# EAGLE design silverduino (EAGLE 8.1.0)
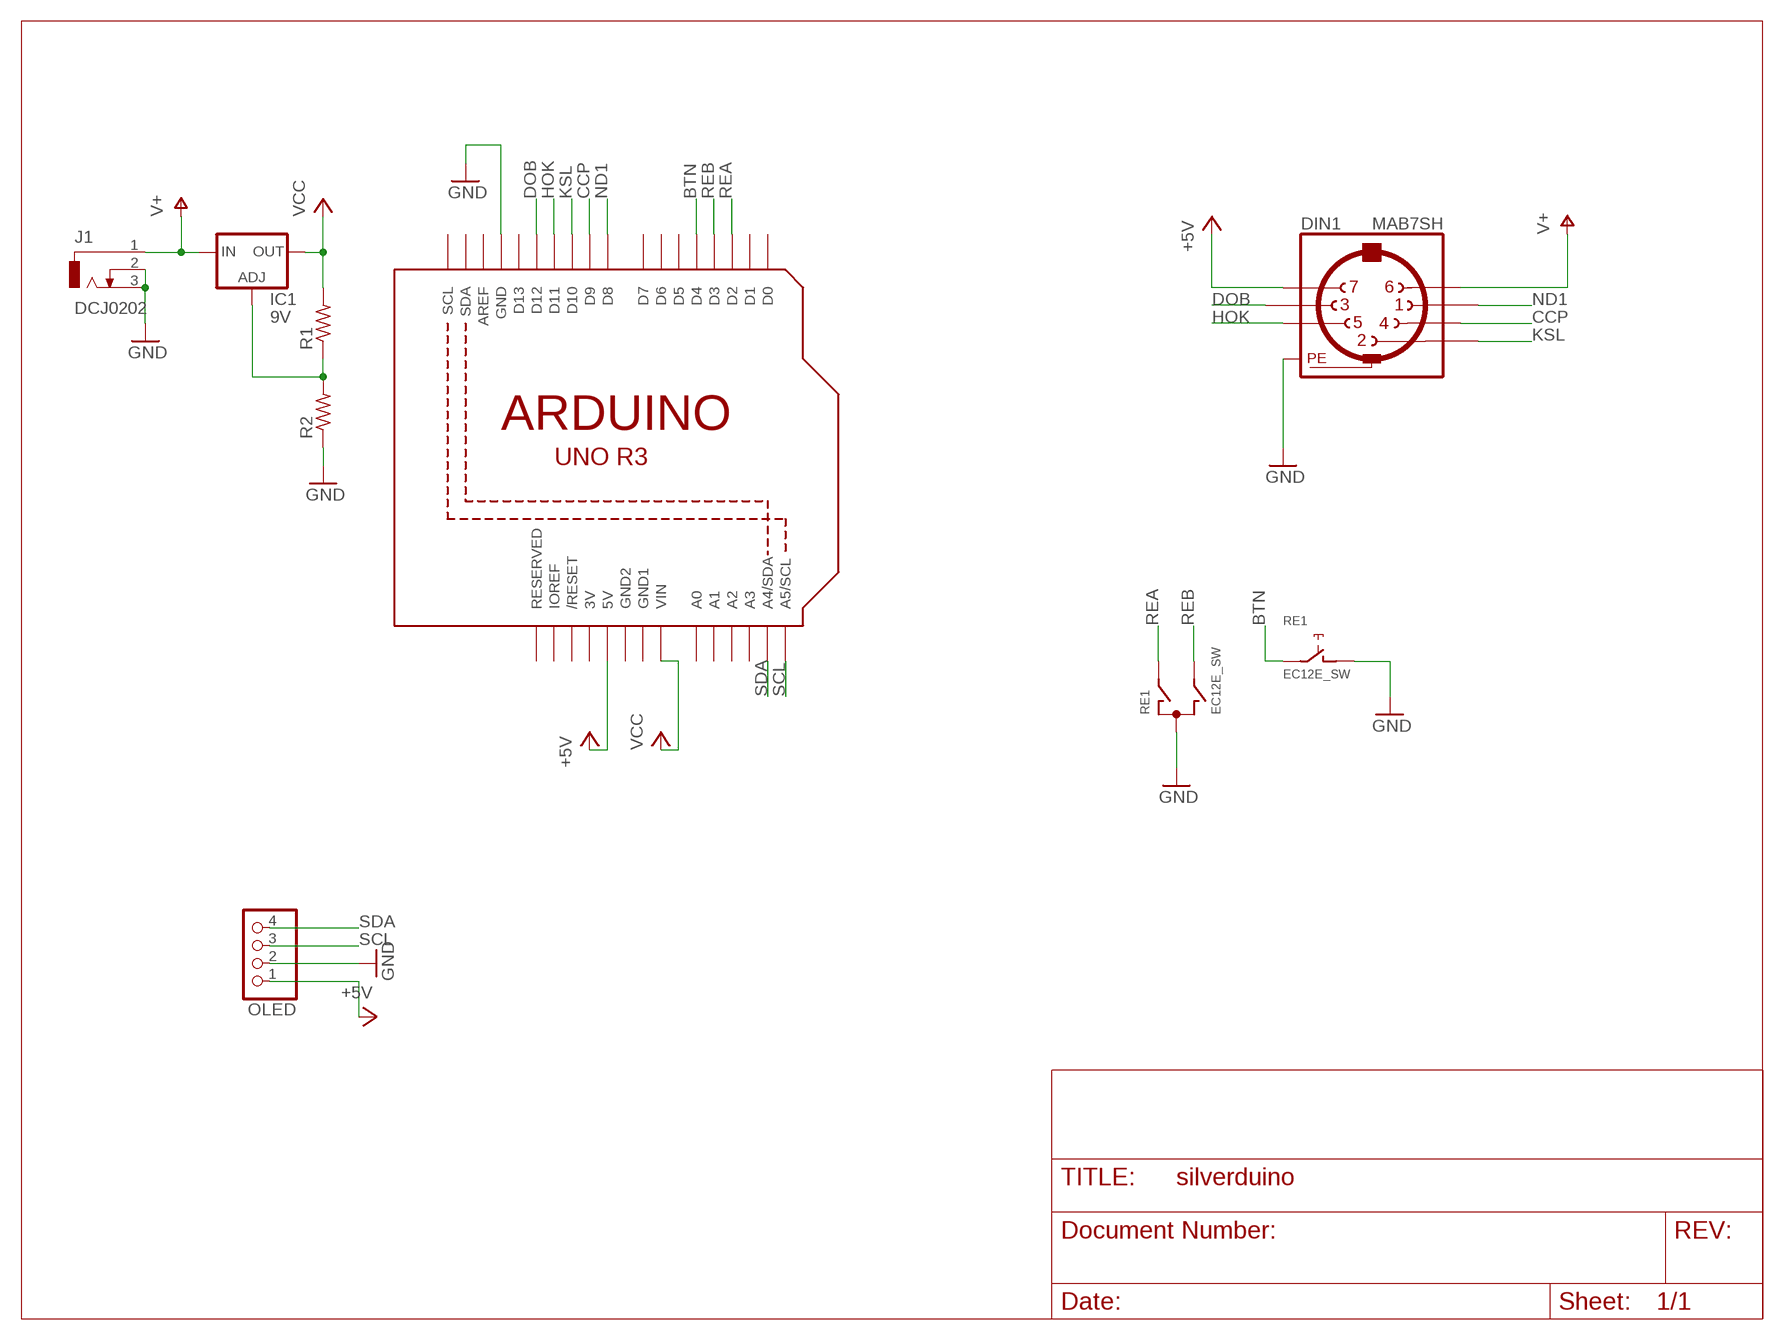
[diagram p0: schematic, sheet 1]

## Parts
DIN1  MAB7SH  [MAB7SH]
IC1  9V  LM317TL  [317TL]
J1  DCJ0202  [DCJ0202]
OLED  PINHD-1X4  [1X04]
R1  R-US_0207/10  [0207/10]
R2  R-US_0207/10  [0207/10]
RE1  EC12E_SW  [ALPS_EC12E_SW]
U1  ARDUINOR3-DIMENSION  [ARDUINOR3]

## Nets
+5V: DIN1.7 OLED.1 U1.5V
BTN: RE1.E U1.D4
CCP: DIN1.4 U1.D9
DOB: DIN1.3 U1.D12
GND: DIN1.PE DIN1.PE@(PE) J1.2 J1.3 OLED.2 R2.1 RE1.C RE1.D U1.GND
HOK: DIN1.5 U1.D11
KSL: DIN1.2 U1.D10
N$3: IC1.1(ADJ) R1.1 R2.2
ND1: DIN1.1 U1.D8
REA: RE1.A U1.D2
REB: RE1.B U1.D3
SCL: OLED.3 U1.A5(A5/SCL)
SDA: OLED.4 U1.A4(A4/SDA)
V+: DIN1.6 IC1.3(IN) J1.1
VCC: IC1.2(OUT) R1.2 U1.VIN
Unconnected: RE1.GND1(G) RE1.GND2(G) U1.A0 U1.A1 U1.A2 U1.A3 U1.AREF U1.D0 U1.D1 U1.D5 U1.D6 U1.D7 U1.D13 U1.IOREF U1.RESERVED U1.RESET(/RESET) U1.SCL U1.SDA

## Power pins joined to a net without a drawn wire
3V: U1.3V
GND1: U1.GND1
GND2: U1.GND2

## Library data of the parts
DIN1 = con-hirschmann:MAB7SH: Female CONNECTOR 7 pins with shield, horizontal (DIN 45329); OC_FARNELL: unknown; OC_NEWARK: unknown
IC1 = v-reg:LM317TL: VOLTAGE REGULATOR
J1 = con-jack:DCJ0202: DC POWER JACK Source: DCJ0202.pdf; OC_FARNELL: unknown; OC_NEWARK: unknown
OLED = pinhead:PINHD-1X4: PIN HEADER
R1 R2 = resistor:R-US_: RESISTOR, American symbol
RE1 = switch-alps:EC12E_SW: ALPS rotary Encoder EC12E series with switch; MPN: EC12E2424407; OC_FARNELL: 1520813; OC_NEWARK: 74M1068
U1 = adafruit:ARDUINOR3: This is a new object for the new Arduino R3 - with extra pins that you may want to use (such as IOref, and duplicated A4/A5

## Board
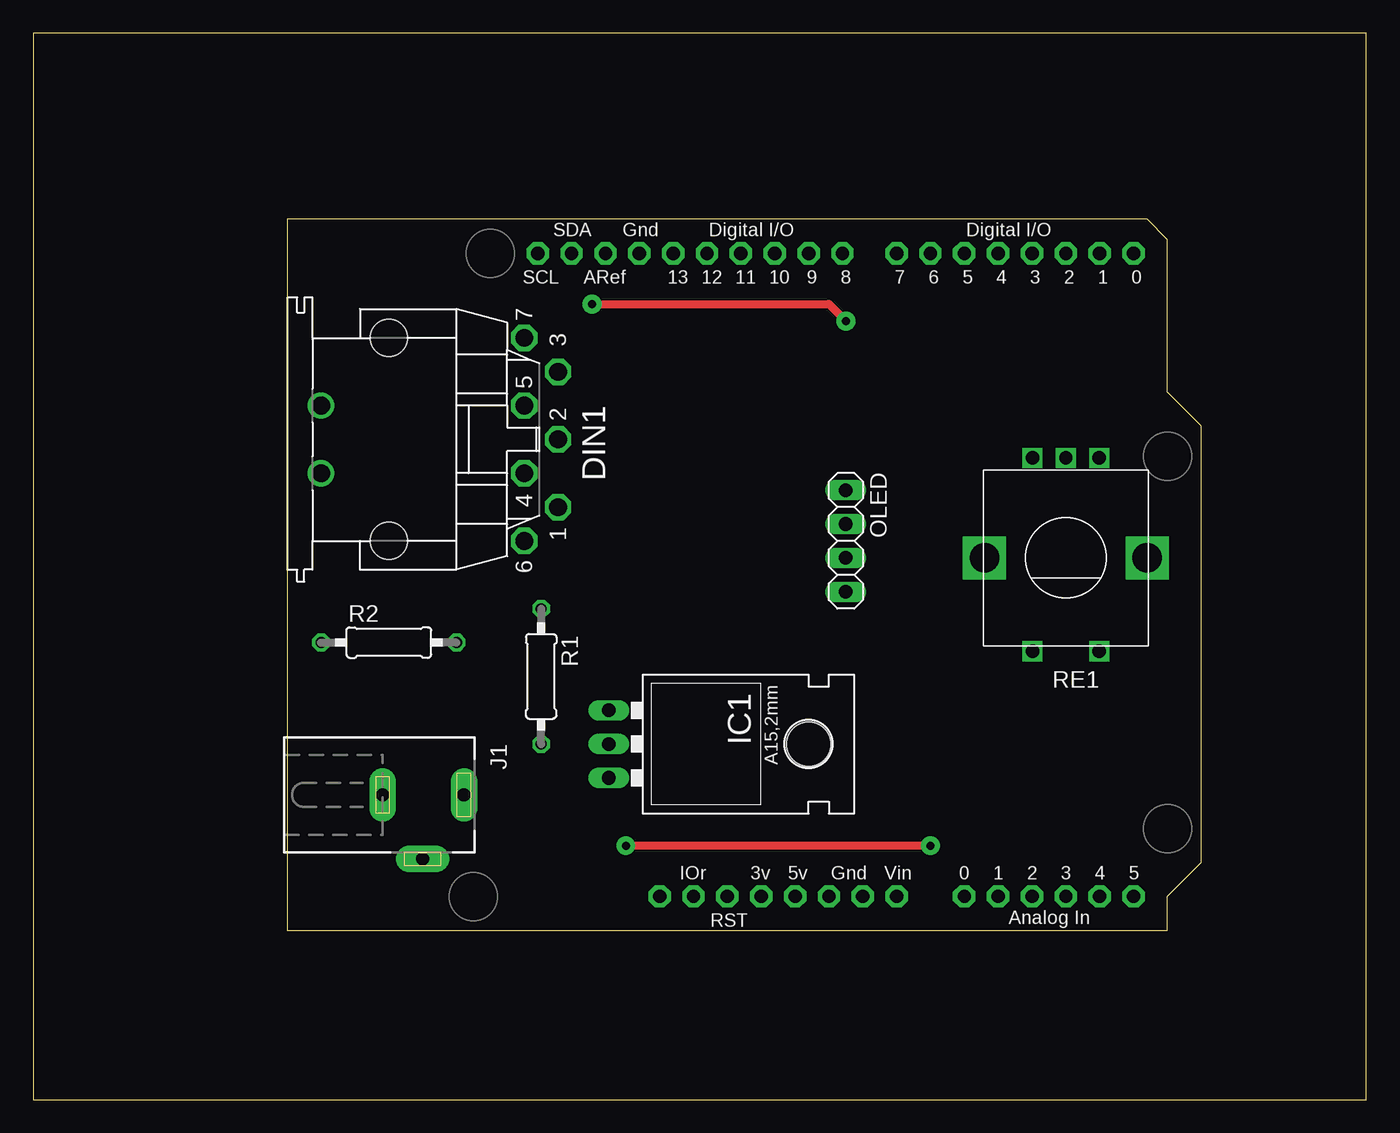
[diagram p1: board, top side]
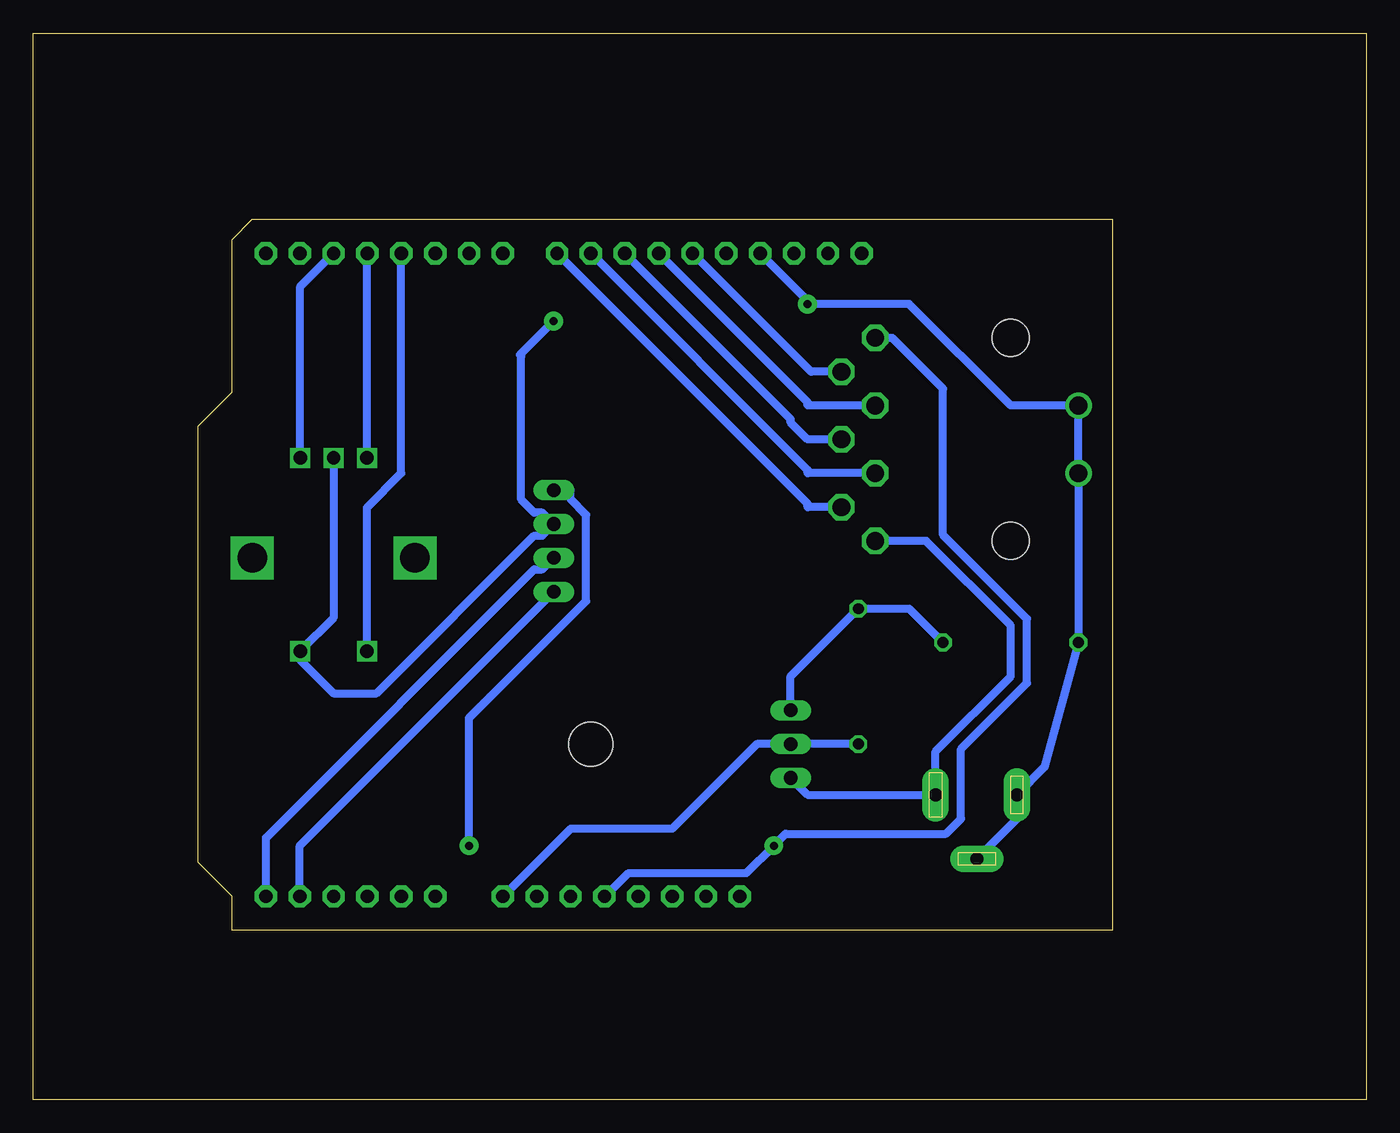
[diagram p2: board, bottom side, seen from below]

Size 100 x 80 mm. Coordinates in mm from the lower left corner, seen from the top.
Outline: 0,0 100,0 100,80 0,80 0,0
Copper layers (1*16): Top 0.035mm / dielectric 1.5mm / Bottom 0.035mm
Design rules "default *": minimum track width 24mil, minimum drill 24mil, track to track 24mil, track to pad 24mil, pad to pad 8mil, via to via 8mil, smd to smd 8mil, copper to edge 40mil, drill to drill 8mil, minimum pad ring 10mil, minimum via ring 8mil, stop-mask expansion 4mil, vias tented up to drill 0mil, thermal gap 10mil

### Footprints (pad centres in the part's own frame; a part is rotated, then mirrored left to right if it is on the bottom)
MAB7SH = drill 1.321 octagon: 1 5.08,12.7; 2 0,12.7; 3 -5.08,12.7; 4 2.54,10.16; 5 -2.54,10.16; 6 7.62,10.16; 7 -7.62,10.16 | drill 1.321: PE -2.54,-5.08; PE@ 2.54,-5.08 | hole 2.794: 7.62,0; -7.62,0
317TL = drill 1.016 long: 1 -2.54,-3.81; 2 0,-3.81; 3 2.54,-3.81 | hole 3.302: 0,11.176
DCJ0202 = drill 1 pad 2 long: 1 0,3.1; 2 4.8,0; 3 0,-3
1X04 = drill 1.016 long: 1 -3.81,0; 2 -1.27,0; 3 1.27,0; 4 3.81,0
0207/10 = drill 0.813 octagon: 1 -5.08,0; 2 5.08,0
ALPS_EC12E_SW = drill 1 square: A -2.5,-7.5; B 2.5,-7.5; C 0,-7.5; D -2.5,7; E 2.5,7 | drill 2.2 square: GND1 -6.1,0; GND2 6.1,0
ARDUINOR3 = drill 1 pad 1.676 octagon: 3V 35.56,2.54; 5V 38.1,2.54; A0 50.8,2.54; A1 53.34,2.54; A2 55.88,2.54; A3 58.42,2.54; A4 60.96,2.54; A5 63.5,2.54; AREF 23.876,50.8; D0 63.5,50.8; D1 60.96,50.8; D2 58.42,50.8; D3 55.88,50.8; D4 53.34,50.8; D5 50.8,50.8; D6 48.26,50.8; D7 45.72,50.8; D8 41.656,50.8; D9 39.116,50.8; D10 36.576,50.8; D11 34.036,50.8; D12 31.496,50.8; D13 28.956,50.8; GND 26.416,50.8; GND1 43.18,2.54; GND2 40.64,2.54; IOREF 30.48,2.54; RESERVED 27.94,2.54; RESET 33.02,2.54; SCL 18.796,50.8; SDA 21.336,50.8; VIN 45.72,2.54

### Placement (x,y rotation side)
DIN1  26.67,49.53 270 top
IC1  46.99,26.67 270 top
J1  29.21,22.86 270 top
OLED  60.96,41.91 270 top
R1  38.1,31.75 270 top
R2  26.67,34.29 0 top
RE1  77.47,40.64 180 top
U1  19.05,12.7 0 top

### Tracks (layer width: path | path; a pad name or v marks a point on that pad's centre or on a via)
+5V  (via drill 0.6 pad 1.42)
  Top 0.61: v67.31,19.05 v44.45,19.05
  Bottom 0.61: U1.5V 57.09,15.24 55.34,16.99 46.51,16.99 v44.45,19.05 43.55,19.95 31.52,19.95 30.4,21.07 30.4,26.3 25.45,31.25 25.45,36.06 31.75,42.36 31.75,53.34 35.56,57.15 DIN1.7 | v67.31,19.05 67.31,28.62 58.52,37.41 58.52,43.87 59.69,45.04 59.69,45.72 OLED.1
BTN
  Bottom 0.61: RE1.E 74.97,44.41 72.39,46.99 U1.D4
CCP
  Bottom 0.61: DIN1.4 41.91,46.99 41.91,47.24 U1.D9
DOB
  Bottom 0.61: DIN1.3 41.66,54.61 U1.D12
GND  (via drill 0.6 pad 1.42)
  Top 0.61: v41.91,59.69 59.69,59.69 v60.96,58.42
  Bottom 0.61: J1.2 26.21,21.06 J1.3 24.13,24.94 R2.1 DIN1.PE@ DIN1.PE 26.67,52.07 34.29,59.69 v41.91,59.69 41.91,59.94 U1.GND | RE1.C 77.47,36.14 RE1.D 79.97,32.98 77.47,30.48 74.25,30.48 62.42,42.32 61.82,42.32 OLED.2 61.82,44.04 62.42,44.04 63.4,45.03 63.4,55.78 63.5,55.88 v60.96,58.42
HOK
  Bottom 0.61: DIN1.5 41.91,52.07 41.91,52.32 U1.D11
KSL
  Bottom 0.61: DIN1.2 41.91,49.53 43.18,50.8 43.18,51.05 U1.D10
N$3
  Bottom 0.61: IC1.1 43.18,31.75 R1.1 34.29,36.83 R2.2
ND1
  Bottom 0.61: DIN1.1 41.91,44.45 41.91,44.7 U1.D8
REA
  Bottom 0.61: RE1.A 79.97,61 U1.D2
REB
  Bottom 0.61: RE1.B 74.97,63.46 U1.D3
SCL
  Bottom 0.61: OLED.3 61.82,39.78 62.42,39.78 82.55,19.64 U1.A5
SDA
  Bottom 0.61: U1.A4 80.01,19.05 OLED.4
V+
  Bottom 0.61: IC1.3 41.91,22.86 J1.1 32.31,26.11 26.67,31.75 26.67,35.56 33.02,41.91 DIN1.6
VCC
  Bottom 0.61: R1.2 IC1.2 45.72,26.67 52.07,20.32 59.69,20.32 U1.VIN